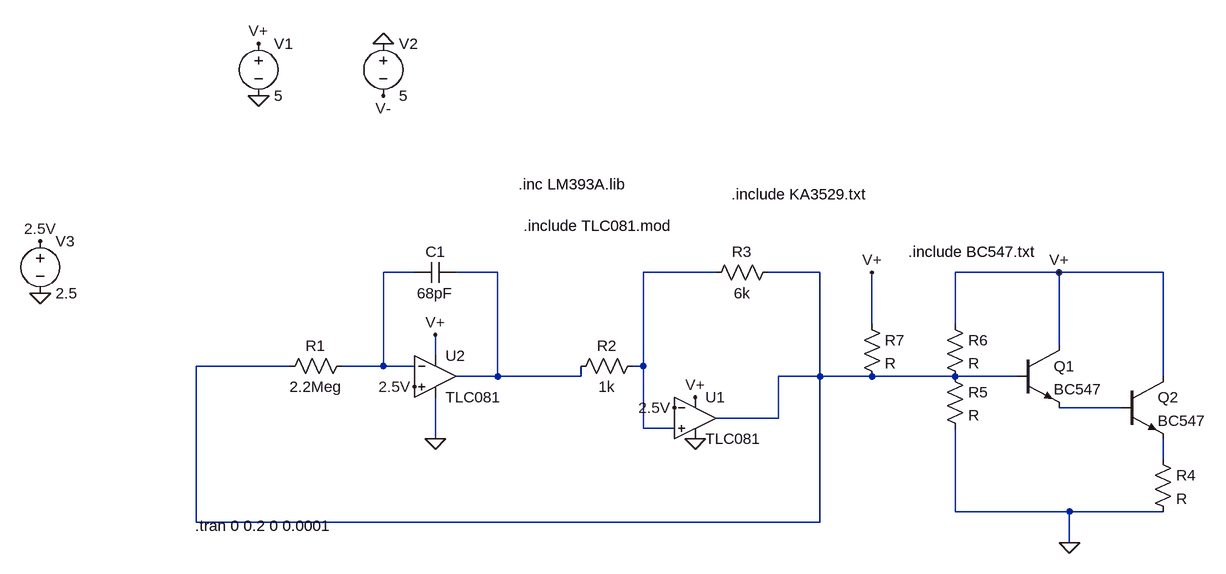
[diagram p0: schematic 310_circuits.asc]
310_circuits.asc, the LTspice schematic file:
Version 4
SHEET 1 1876 1604
WIRE 192 64 144 64
WIRE 320 64 256 64
WIRE 656 64 544 64
WIRE 816 64 736 64
WIRE 1184 64 1024 64
WIRE 1344 64 1184 64
WIRE 896 144 896 64
WIRE 1024 144 1024 64
WIRE 1184 176 1184 64
WIRE 224 192 224 160
WIRE 0 208 -144 208
WIRE 144 208 144 64
WIRE 144 208 80 208
WIRE 192 208 144 208
WIRE 544 208 544 64
WIRE 544 208 528 208
WIRE 320 224 320 64
WIRE 320 224 256 224
WIRE 448 224 448 208
WIRE 448 224 320 224
WIRE 816 224 816 64
WIRE 816 224 752 224
WIRE 896 224 816 224
WIRE 1024 224 896 224
WIRE 1120 224 1024 224
WIRE 1344 224 1344 64
WIRE 1280 272 1184 272
WIRE 752 288 752 224
WIRE 752 288 656 288
WIRE 544 304 544 208
WIRE 592 304 544 304
WIRE 224 320 224 256
WIRE 1344 352 1344 320
WIRE 1024 432 1024 304
WIRE 1200 432 1024 432
WIRE 1344 432 1200 432
WIRE -144 448 -144 208
WIRE 816 448 816 224
WIRE 816 448 -144 448
WIRE 1200 480 1200 432
FLAG 144 -288 0
FLAG -48 -208 0
FLAG 144 -208 V-
FLAG -48 -288 V+
FLAG 224 160 V+
FLAG 624 256 V+
FLAG -384 96 0
FLAG -384 16 2.5V
FLAG 192 240 2.5V
FLAG 592 272 2.5V
FLAG 224 320 0
FLAG 624 320 0
FLAG 1200 480 0
FLAG 896 64 V+
FLAG 1184 64 V+
SYMBOL res 96 192 R90
WINDOW 0 0 56 VBottom 2
WINDOW 3 32 56 VTop 2
SYMATTR InstName R1
SYMATTR Value 2.2Meg
SYMBOL res 544 192 R90
WINDOW 0 0 56 VBottom 2
WINDOW 3 32 56 VTop 2
SYMATTR InstName R2
SYMATTR Value 1k
SYMBOL res 752 48 R90
WINDOW 0 0 56 VBottom 2
WINDOW 3 32 56 VTop 2
SYMATTR InstName R3
SYMATTR Value 6k
SYMBOL cap 256 48 R90
WINDOW 0 0 32 VBottom 2
WINDOW 3 32 32 VTop 2
SYMATTR InstName C1
SYMATTR Value 68pF
SYMBOL voltage -48 -304 R0
WINDOW 123 0 0 Left 0
WINDOW 39 0 0 Left 0
SYMATTR InstName V1
SYMATTR Value 5
SYMBOL voltage 144 -304 R0
WINDOW 123 0 0 Left 0
WINDOW 39 0 0 Left 0
SYMATTR InstName V2
SYMATTR Value 5
SYMBOL OpAmps\\opamp2 624 224 R0
SYMATTR InstName U1
SYMATTR Value TLC081
SYMBOL OpAmps\\opamp2 224 160 R0
SYMATTR InstName U2
SYMATTR Value TLC081
SYMBOL voltage -384 0 R0
WINDOW 123 0 0 Left 0
WINDOW 39 0 0 Left 0
SYMATTR InstName V3
SYMATTR Value 2.5
SYMBOL npn 1120 176 R0
SYMATTR InstName Q1
SYMATTR Value BC547
SYMBOL npn 1280 224 R0
SYMATTR InstName Q2
SYMATTR Value BC547
SYMBOL res 1328 336 R0
SYMATTR InstName R4
SYMBOL res 1008 208 R0
SYMATTR InstName R5
SYMBOL res 1008 128 R0
SYMATTR InstName R6
SYMBOL res 880 128 R0
SYMATTR InstName R7
TEXT -146 454 Left 2 !.tran 0 0.2 0 0.0001
TEXT 352 -72 Left 2 !.inc LM393A.lib
TEXT 360 -8 Left 2 !.include TLC081.mod
TEXT 680 -56 Left 2 !.include KA3529.txt
TEXT 952 32 Left 2 !.include BC547.txt

The netlist it stands for:
* 310_circuits.asc
R1 N001 N004 2.2Meg
R2 N003 N002 1k
R3 N004 N003 6k
C1 N002 N001 68pF
V1 V+ 0 5
V2 0 V- 5
XU1 N003 2.5V V+ 0 N004 TLC081  ; pins In+ In- V+ V- OUT
XU2 2.5V N001 V+ 0 N002 TLC081  ; pins In+ In- V+ V- OUT
V3 2.5V 0 2.5
Q1 V+ N004 N005 0 BC547
Q2 V+ N005 N006 0 BC547
R4 N006 0 R
R5 N004 0 R
R6 V+ N004 R
R7 V+ N004 R
.model NPN NPN
.model PNP PNP
.lib standard.bjt
.tran 0 0.2 0 0.0001
.inc LM393A.lib
.include TLC081.mod
.include KA3529.txt
.include BC547.txt
.backanno
.end